# Altium schematic sheet top.SchDoc: Triumvi - Sensing - Top
size Letter; Author: Ye-Sheng Kuo; Revision: 9; SheetNumber: 1; SheetTotal: 6
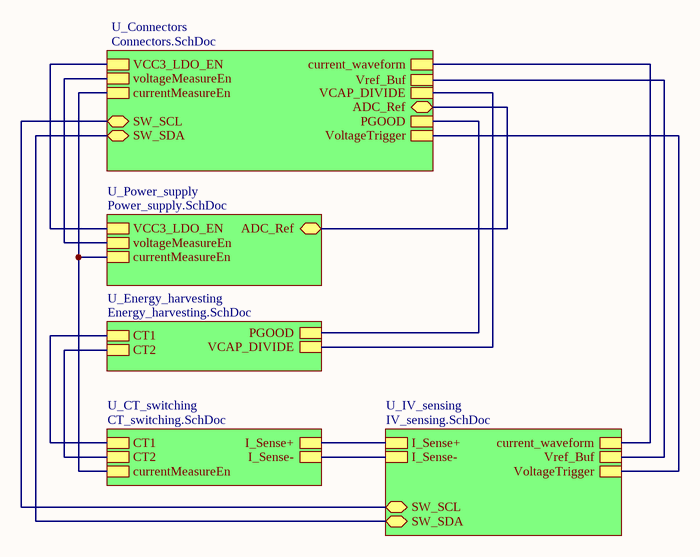
[diagram p0: top.SchDoc]

## Sub-sheets
U_Connectors = Connectors.SchDoc: current_waveform, Vref_Buf, VoltageTrigger, PGOOD, VCAP_DIVIDE, VCC3_LDO_EN, voltageMeasureEn, currentMeasureEn, SW_SCL, SW_SDA, ADC_Ref
U_CT_switching = CT_switching.SchDoc: CT1, CT2, currentMeasureEn, I_Sense+, I_Sense-
U_Energy_harvesting = Energy_harvesting.SchDoc: CT1, CT2, PGOOD, VCAP_DIVIDE
U_IV_sensing = IV_sensing.SchDoc: current_waveform, Vref_Buf, VoltageTrigger, I_Sense+, I_Sense-, SW_SCL, SW_SDA
U_Power_supply = Power_supply.SchDoc: VCC3_LDO_EN, voltageMeasureEn, currentMeasureEn, ADC_Ref

## Nets
(unnamed): sheet U_Connectors/current_waveform, sheet U_IV_sensing/current_waveform
(unnamed): sheet U_Connectors/Vref_Buf, sheet U_IV_sensing/Vref_Buf
(unnamed): sheet U_Connectors/VoltageTrigger, sheet U_IV_sensing/VoltageTrigger
(unnamed): sheet U_Connectors/PGOOD, sheet U_Energy_harvesting/PGOOD
(unnamed): sheet U_Connectors/VCAP_DIVIDE, sheet U_Energy_harvesting/VCAP_DIVIDE
(unnamed): sheet U_Connectors/VCC3_LDO_EN, sheet U_Power_supply/VCC3_LDO_EN
(unnamed): sheet U_Connectors/voltageMeasureEn, sheet U_Power_supply/voltageMeasureEn
(unnamed): sheet U_Connectors/currentMeasureEn, sheet U_CT_switching/currentMeasureEn, sheet U_Power_supply/currentMeasureEn
(unnamed): sheet U_Connectors/SW_SCL, sheet U_IV_sensing/SW_SCL
(unnamed): sheet U_Connectors/SW_SDA, sheet U_IV_sensing/SW_SDA
(unnamed): sheet U_Connectors/ADC_Ref, sheet U_Power_supply/ADC_Ref
(unnamed): sheet U_CT_switching/CT1, sheet U_Energy_harvesting/CT1
(unnamed): sheet U_CT_switching/CT2, sheet U_Energy_harvesting/CT2
(unnamed): sheet U_CT_switching/I_Sense+, sheet U_IV_sensing/I_Sense+
(unnamed): sheet U_CT_switching/I_Sense-, sheet U_IV_sensing/I_Sense-

## Notes on the sheet
- Title
- Date:
- Author:
- Revision:
- Sheet
- of
- University of Michigan
- File: